# Altium schematic sheet MGNGSQ4_HeaterDongle.SchDoc
size A
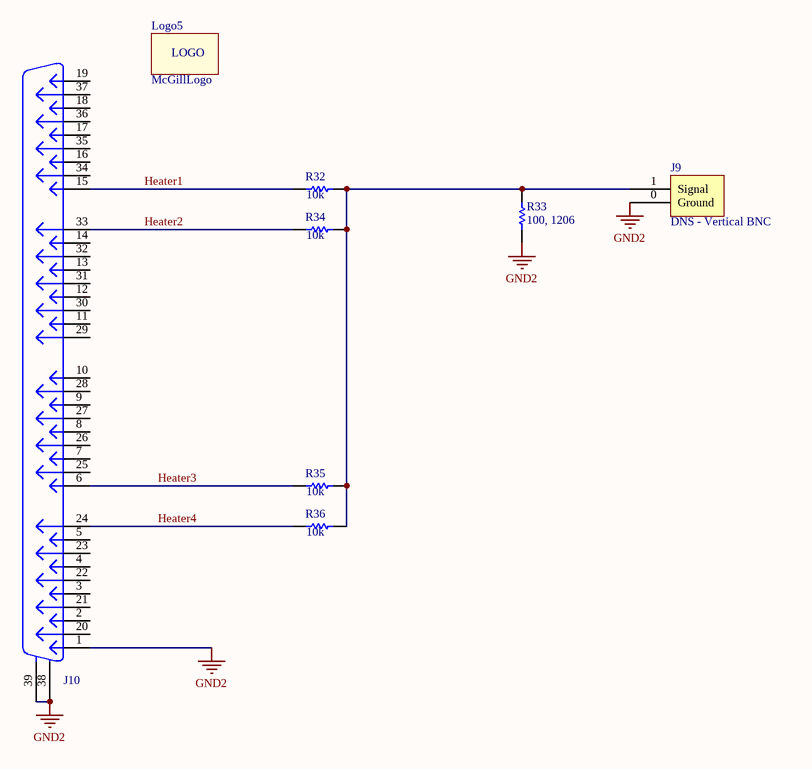
[diagram p0: MGNGSQ4_HeaterDongle.SchDoc]

## Parts
J9  DNS - Vertical BNC  [BNCVert]
J10  DB37M  [DSUB37-M]  (value not drawn)
Logo5  McGillLogo  [McGillLogo1]  (no BOM)
R32  10k  [0603]
R33  100, 1206  [1206]
R34  10k  [0603]
R35  10k  [0603]
R36  10k  [0603]

## Nets
GND2: J9.0(Ground) J10.1 J10.38(MH1) J10.39(MH2) R33.1
Heater1: J10.15 R32.1
Heater2: J10.33 R34.1
Heater3: J10.6 R35.1
Heater4: J10.24 R36.1
NetJ9_1: J9.1(Signal) R32.2 R33.2 R34.2 R35.2 R36.2

Not connected (* = marked no-connect by the designer): J10 2 3 4 5 7 8 9 10 11 12 13 14 16 17 18 19 20 21 22 23 25 26 27 28 29 30 31 32 34 35 36 37

## Notes on the sheet
- (in symbol Logo) LOGO

## Library data of the parts
J9 = BNCVertical: Vertical BNC; Manufacturer: TE Connectivity AMP Connectors; Manufacturer Part Number: 5-1634503-1; Assembly Comments: none; Value: 5-1634503-1; Supplier: Digikey; Cost: $2.79; Part Constraints: 5-1634503-1; Supplier Part Number: A97581-ND; Type: DNS
J10 = DB37M: Manufacturer: Norcomp; Part Constraints: 182-037-113R531; Assembly Comments: none; Cost: $4.32; Manufacturer Part Number: 182-037-113R531; Supplier: Digikey; Supplier Part Number: 182-37ME-ND; Value: DB37M; Type: thru-hole
Logo5 = Logo: Silkscreen Logo; Manufacturer: McGill; Assembly Comments: none; Value: McGillLogo; Cost: $0; Type: SMD
R32 R34-R36 = RES 0603: 10k Ohm RES 0603; Manufacturer: Vishay Dale; Part Constraints: RES 10k OHM 1/10W 1% 0603 SMD; Manufacturer Part Number: CRCW060310K0FKEA; Assembly Comments: none; Value: 10k; Cost: $0.124; Supplier: Digikey; Supplier Part Number: 541-10.0KHCT-ND; Type: SMD
R33 = RES 1206: 100 Ohm RES 1/4W 1206 SMD; Manufacturer: Rohm Semiconductor; Part constraints: 100 Ohm, 1206, 100ppm, 1%, 1/3W; Manufacturer Part Number: ESR18EZPF1000; Value: 100; Assembly Comments: none; Supplier: Digikey; Cost: $0.21; Supplier Part Number: RHM100AFCT-ND; Type: SMD